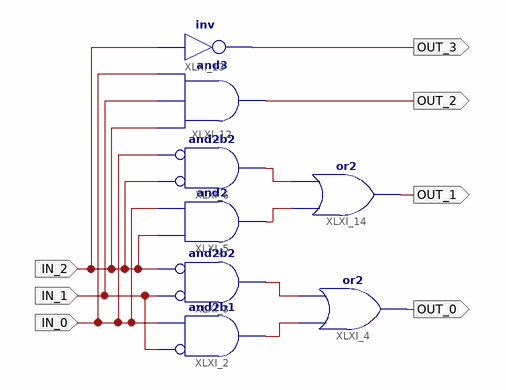
[diagram p0: schematic sheet 1]
// Xilinx ISE schematic Schematic.sch (spartan3a) as structural Verilog: 8 symbols, 7 ports
module Schematic (
  input  IN_2,
  input  IN_1,
  input  IN_0,
  output OUT_0,
  output OUT_3,
  output OUT_2,
  output OUT_1
);

  wire XLXN_5, XLXN_6, XLXN_40, XLXN_41;

  and XLXI_2 (XLXN_6, ~IN_1, IN_0);  // and2b1
  and XLXI_3 (XLXN_5, ~IN_1, ~IN_2);  // and2b2
  or XLXI_4 (OUT_0, XLXN_6, XLXN_5);
  and XLXI_5 (XLXN_41, IN_2, IN_0);
  and XLXI_6 (XLXN_40, ~IN_2, ~IN_0);  // and2b2
  and XLXI_12 (OUT_2, IN_2, IN_1, IN_0);
  not XLXI_13 (OUT_3, IN_2);
  or XLXI_14 (OUT_1, XLXN_41, XLXN_40);
endmodule
